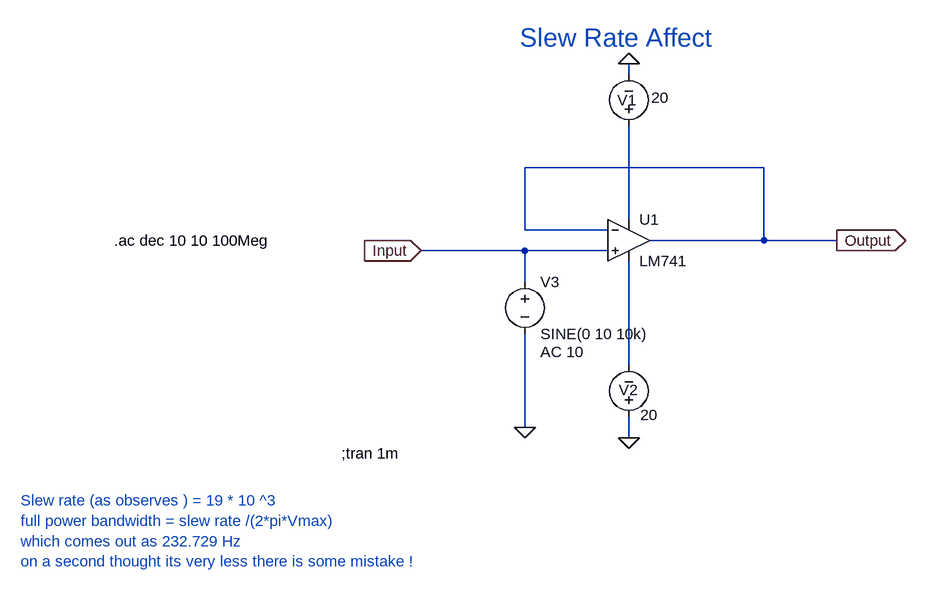
[diagram p0: schematic OpAmpSlewRateEffects.asc]
OpAmpSlewRateEffects.asc, the LTspice schematic file:
Version 4
SHEET 1 880 680
WIRE 224 -80 224 -96
WIRE 432 64 64 64
WIRE 224 144 224 0
WIRE 64 160 64 64
WIRE 192 160 64 160
WIRE 432 176 432 64
WIRE 432 176 256 176
WIRE 544 176 432 176
WIRE 64 192 -96 192
WIRE 192 192 64 192
WIRE 64 240 64 192
WIRE 224 368 224 208
WIRE 64 464 64 320
WIRE 224 480 224 448
FLAG 224 -96 0
FLAG 224 480 0
FLAG 64 464 0
FLAG 544 176 Output
IOPIN 544 176 Out
FLAG -96 192 Input
IOPIN -96 192 In
SYMBOL OpAmps\\LM741 224 112 R0
SYMATTR InstName U1
SYMBOL voltage 224 16 R180
WINDOW 0 -12 56 Left 2
WINDOW 3 -62 60 Left 2
WINDOW 123 0 0 Left 0
WINDOW 39 0 0 Left 0
SYMATTR InstName V1
SYMATTR Value 20
SYMBOL voltage 224 464 R180
WINDOW 0 -14 58 Left 2
WINDOW 3 -45 19 Left 2
WINDOW 123 0 0 Left 0
WINDOW 39 0 0 Left 0
SYMATTR InstName V2
SYMATTR Value 20
SYMBOL voltage 64 224 R0
WINDOW 123 24 124 Left 2
WINDOW 39 0 0 Left 0
SYMATTR InstName V3
SYMATTR Value SINE(0 10 10k)
SYMATTR Value2 AC 10
TEXT 56 -136 Left 4 ;Slew Rate Affect
TEXT -218 504 Left 2 !;tran 1m
TEXT -568 176 Left 2 !.ac dec 10 10 100Meg
TEXT -712 576 Left 2 ;Slew rate (as observes ) = 19 * 10 ^3
TEXT -712 608 Left 2 ;full power bandwidth = slew rate /(2*pi*Vmax)\nwhich comes out as 232.729 Hz\non a second thought its very less there is some mistake !

The netlist it stands for:
* OpAmpSlewRateEffects.asc
XU1 Input Output N001 N002 Output LM741  ; pins In+ In- V+ V- OUT
V1 N001 0 20
V2 0 N002 20
V3 Input 0 SINE(0 10 10k) AC 10
* Slew Rate Affect
;tran 1m
.ac dec 10 10 100Meg
* Slew rate (as observes ) = 19 * 10 ^3
* full power bandwidth = slew rate /(2*pi*Vmax)
* which comes out as 232.729 Hz
* on a second thought its very less there is some mistake !
.lib LM741.lib
.backanno
.end